# Altium schematic sheet Power.SchDoc: NH Speaker Sensor 16CH 2.3_C
size A3; Revision: 2.3; SheetNumber: 1; SheetTotal: 6
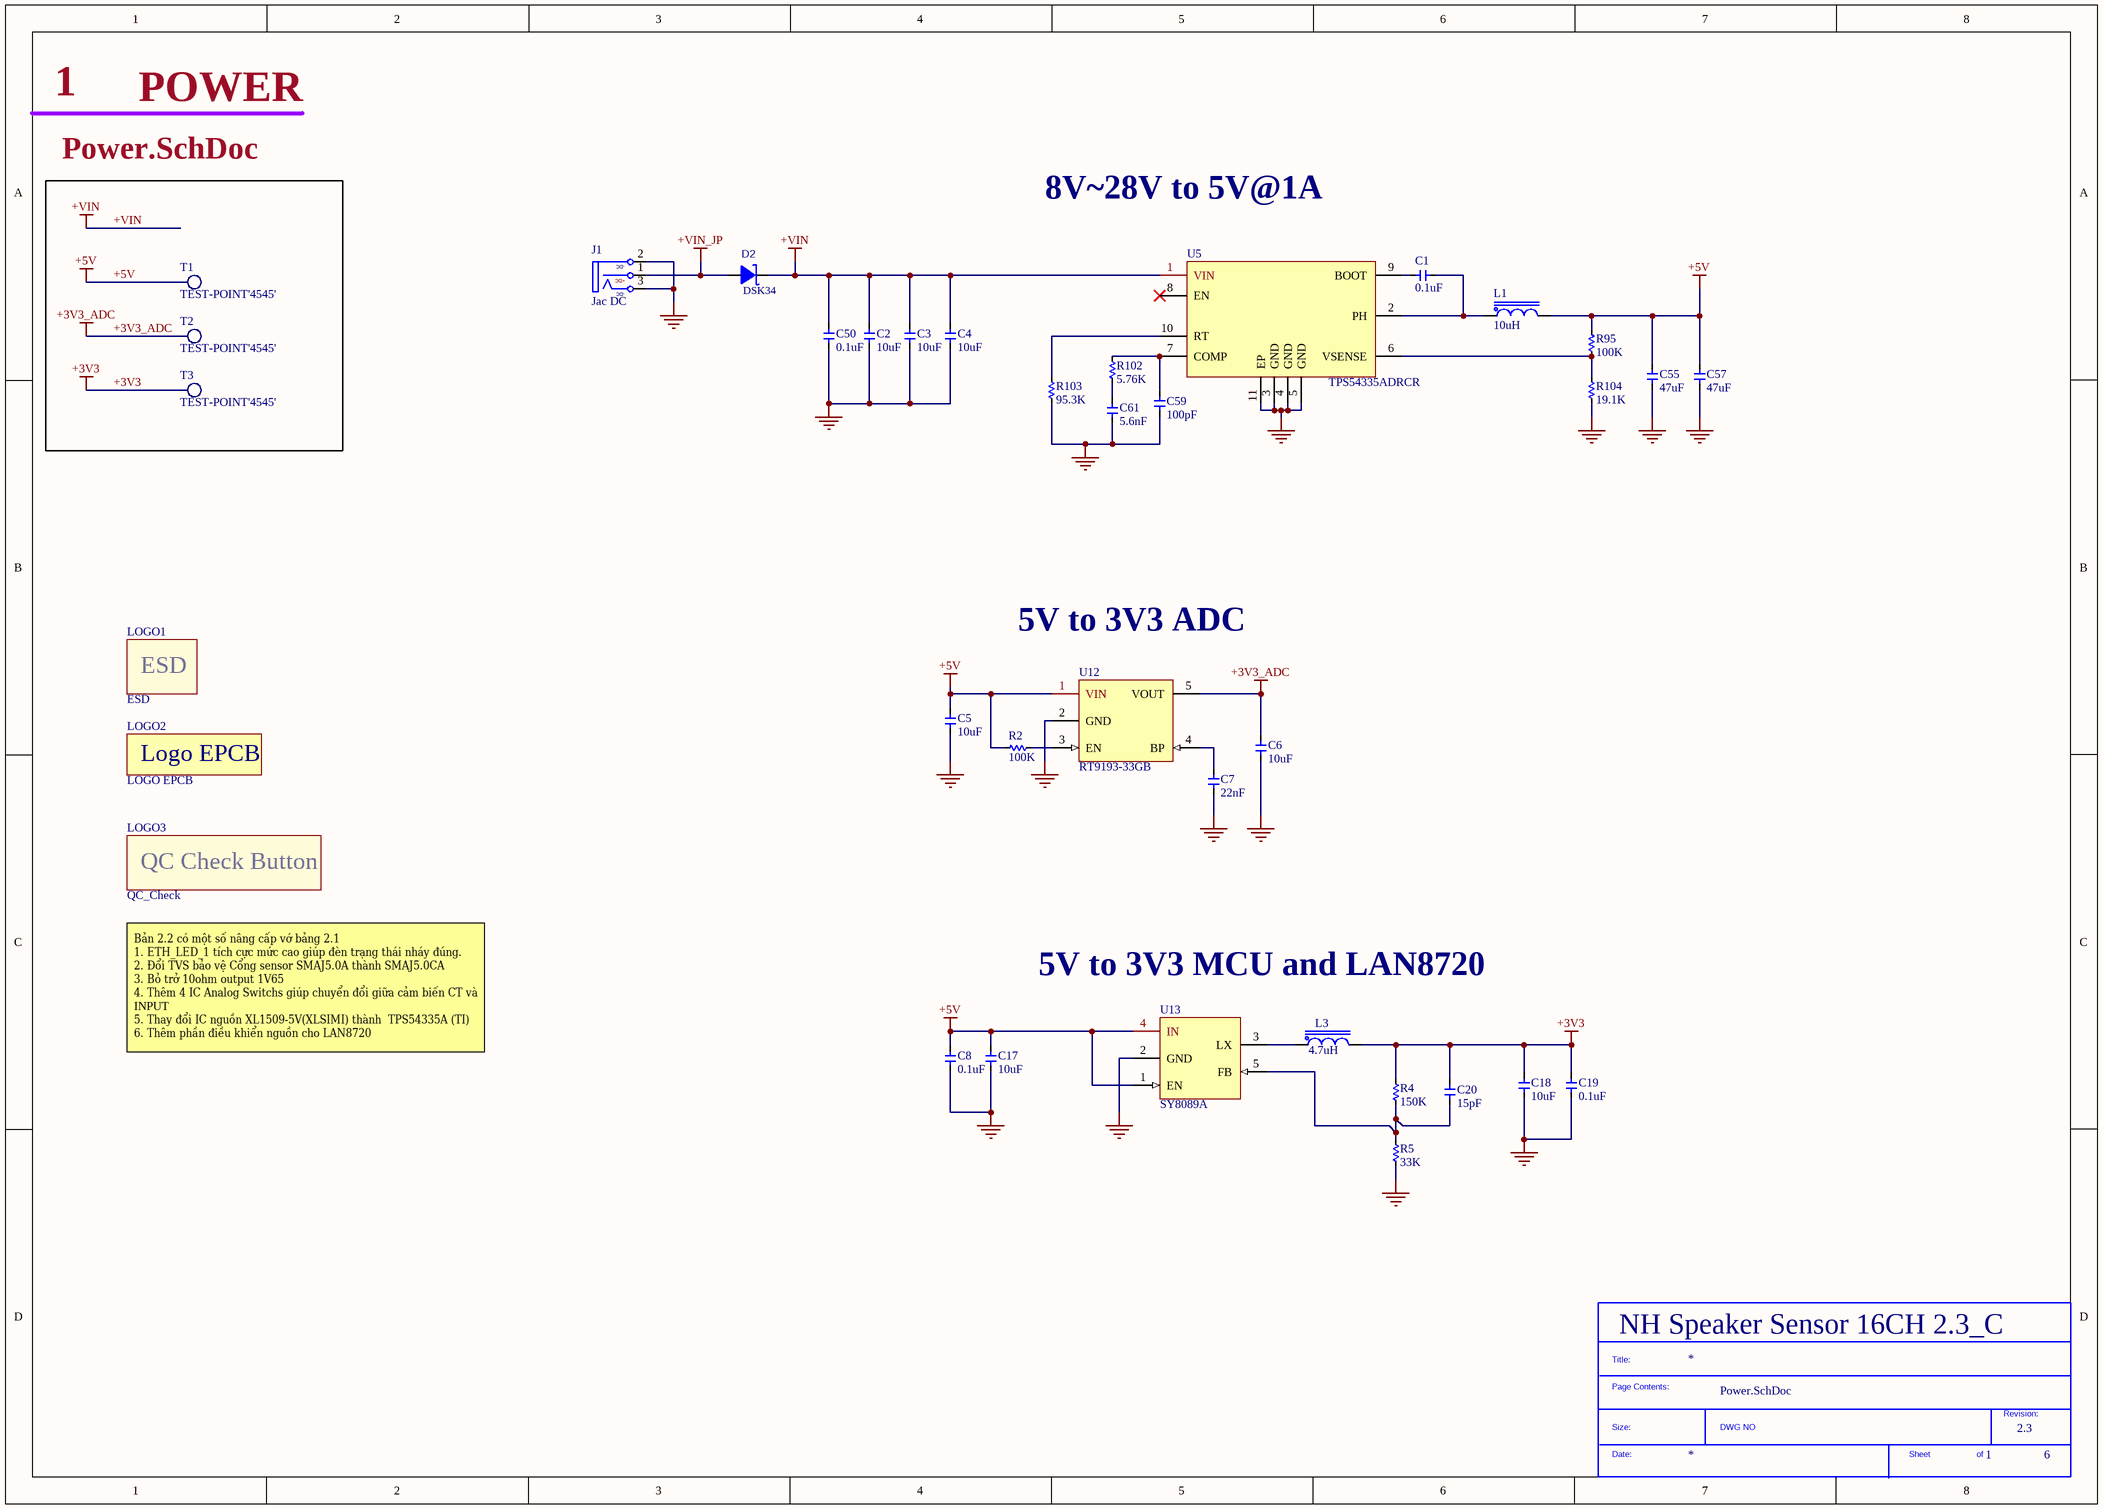
[diagram p0: Power.SchDoc]

## Parts
*?  SDTitleBlock  (value not drawn)  (graphical)
C1  0.1uF  [C_0603]
C2  10uF  [C_0805]
C3  10uF  [C_0805]
C4  10uF  [C_0805]
C5  10uF  [C_0603]
C6  10uF  [C_0603]
C7  22nF  [C_0603]
C8  0.1uF  [C_0603]
C17  10uF  [C_0805]
C18  10uF  [C_0805]
C19  0.1uF  [C_0603]
C20  15pF  [C_0603]
C50  0.1uF  [C_0603]
C55  47uF  [C_0805]
C57  47uF  [C_0805]
C59  100pF  [C_0603]
C61  5.6nF  [C_0603]
D2  DSK34  [SOD-123_L2.8-W1.8-LS3.7-RD]
J1  Jac DC  [DC0]
L1  10uH  [IND-SMD_L4.4-W4.2]
L3  4.7uH  [IND-SMD_L4.4-W4.2]
LOGO1  ESD  [LOGO ESD]  (no BOM)
LOGO2  LOGO EPCB  [LOGO EPCB TopLayer]  (no BOM)
LOGO3  QC_Check  [QC_CHECK]  (no BOM)
R2  100K  [R_0603]
R4  150K  [R_0603]
R5  33K  [R_0603]
R95  100K  [R_0603]
R102  5.76K  [R_0603]
R103  95.3K  [R_0603]
R104  19.1K  [R_0603]
T1  TEST-POINT'4545'  [TP-D45MIL]  (no BOM)
T2  TEST-POINT'4545'  [TP-D45MIL]  (no BOM)
T3  TEST-POINT'4545'  [TP-D45MIL]  (no BOM)
U5  TPS54335ADRCR  [VSON-10_L3.0-W3.0-P0.50-TL-EP]
U12  RT9193-33GB  [SOT-23-5_L3.0-W1.7-P0.95-LS2.8-BR]
U13  SY8089A  [SOT-23-5_L3.0-W1.7-P0.95-LS2.8-BR]

## Nets
+3V3: C18.2 C19.2 C20.2 L3.2 R4.1 T3.T
+3V3_ADC: C6.2 T2.T U12.5(VOUT)
+5V: C5.2 C8.2 C17.2 C55.2 C57.2 L1.2 R2.2 R95.1 T1.T U12.1(VIN) U13.1(EN) U13.4(IN)
+VIN: C2.2 C3.2 C4.2 C50.2 D2.1(A) U5.1(VIN)
+VIN_JP: D2.2(K) J1.1(S)
GND: C2.1 C3.1 C4.1 C5.1 C6.1 C7.1 C8.1 C17.1 C18.1 C19.1 C50.1 C55.1 C57.1 C59.1 C61.1 J1.2(T) J1.3(TN) R5.2 R103.2 R104.2 U5.3(GND) U5.4(GND) U5.5(GND) U5.11(EP) U12.2(GND) U13.2(GND)
NetC1_1: C1.1 L1.1 U5.2(PH)
NetC1_2: C1.2 U5.9(BOOT)
NetC7_2: C7.2 U12.4(BP)
NetC20_1: C20.1 R4.2 R5.1 U13.5(FB)
NetC59_2: C59.2 R102.1 U5.7(COMP)
NetC61_2: C61.2 R102.2
NetL3_1: L3.1 U13.3(LX)
NetR2_1: R2.1 U12.3(EN)
NetR95_2: R95.2 R104.1 U5.6(VSENSE)
NetR103_1: R103.1 U5.10(RT)

Not connected (* = marked no-connect by the designer): U5 8(EN)*

## Notes on the sheet
- POWER
- 8V~28V to 5V@1A
- 5V to 3V3 ADC
- 5V to 3V3 MCU and LAN8720
- (near LOGO3) Bản 2.2 có một số nâng cấp vớ bảng 2.1
  1. ETH_LED_1 tích cực mức cao giúp đèn trạng thái nháy đúng.
  2. Đổi TVS bảo vệ Cổng sensor SMAJ5.0A thành SMAJ5.0CA
  3. Bỏ trở 10ohm output 1V65
  4. Thêm 4 IC Analog Switchs giúp chuyển đổi giữa cảm biến CT và INPUT
  5. Thay đổi IC nguồn XL1509-5V(XLSIMI) thành  TPS54335A (TI)
  6. Thêm phần điều khiển nguồn cho LAN8720
- (in symbol DC+02I) -DC; +DC
- (in symbol LOGO EPCB TopLayer) Logo EPCB
- (in symbol QC_Check) QC Check Button
- (in symbol SDTitleBlock) Title:; Page Contents:; Revision:; Size:; DWG NO; Date:; Sheet; of

## Library data of the parts
*? = SDTitleBlock: TitleBlock
C1 C8 C19 C50 = CC0603KRX7R9BB104: 100NF 50V 0603 ROHS; Manufacturer: YAGEO; Manufacturer Part Number: CC0603KRX7R9BB104; Package: 0603; LCSC Part Number: C14663; Assembly type: SMT Assembly; ComponentLink1Description: Digikey Link; ComponentLink1URL: https://www.digikey.com/en/products/detail/yageo/CC0603KRX7R9BB104/2103082?s=N4IgTCBcDaIMwEYEFoFwCzuWZA5AIiALoC%2BQA; ComponentLink2Description: LCSC Link; ComponentLink2URL: https://jlcpcb.com/parts/componentSearch?searchTxt=10k%200603
C2-C4 C17 C18 = GRM21BR61H106KE43L: 10uF ±10% 50V X5R 0805; Manufacturer: Murata Electronics; ComponentLink1URL: https://lcsc.com/product-detail/Multilayer-Ceramic-Capacitors-MLCC-SMD-SMT_SAMSUNG_CL21A106KAYNNNE_10uF-106-10-25V_C15850.html/?href=jlc-SMT; ComponentLink1Description: LCSC Link; Manufacturer Part Number: GRM21BR61H106KE43L; LCSC Part Number: C440198; Package: 0805; Assembly Type: SMT Assembly
C5 C6 = CL10A106KP8NNNC: 10uF 10V 0603 Multilayer Ceramic Capacitors MLCC - SMD/SMT ROHS; Manufacturer: Samsung Electro-Mechanics; Manufacturer Part Number: CL10A106KP8NNNC; Package: 0603; LCSC Part Number: C19702; ComponentLink1Description: Digikey Link; ComponentLink1URL: https://www.digikey.com/en/products/detail/samsung-electro-mechanics/CL10A105KB8NNNC/3887518?s=N4IgTCBcDaIMIBkCMAGAgqgrAaQEIA4A5YuEAXQF8g; ComponentLink2Description: LCSC Link; ComponentLink2URL: https://jlcpcb.com/parts/componentSearch?searchTxt=10k%200603; Assembly Type: SMT Assembly
C7 = CL10B223KB8NNNC: 22nF 50V 0603 Multilayer Ceramic Capacitors MLCC - SMD/SMT ROHS; Manufacturer: Samsung Electro-Mechanics; Manufacturer Part Number: CL10B223KB8NNNC; Package: 0603; LCSC Part Number: C21122; ComponentLink1Description: Digikey Link; ComponentLink2Description: LCSC Link; ComponentLink2URL: https://jlcpcb.com/parts/componentSearch?searchTxt=10k%200603; Assembly Type: SMT Assembly
C20 = CL10C150JB8NNNC: 15pF ±5% 50V C0G 0603 Multilayer Ceramic Capacitors MLCC - SMD/SMT RoHS; Manufacturer: Samsung Electro-Mechanics; Manufacturer Part Number: CL10C150JB8NNNC; Package: 0603; LCSC Part Number: C1644; ComponentLink1Description: Digikey Link; Assembly Type: SMT Assembly
C55 C57 = GRM21BR61A476ME15L: 47uF ±20% 10V X5R 0805 Multilayer Ceramic Capacitors MLCC - SMD/SMT RoHS; Manufacturer: Murata Electronics; ComponentLink1URL: https://lcsc.com/product-detail/Multilayer-Ceramic-Capacitors-MLCC-SMD-SMT_SAMSUNG_CL21A106KAYNNNE_10uF-106-10-25V_C15850.html/?href=jlc-SMT; ComponentLink1Description: LCSC Link; Manufacturer Part Number: GRM21BR61A476ME15L; LCSC Part Number: C124129; Package: 0805; Assembly Type: SMT Assembly
C59 = 0603CG101J500NT: 100pF 50V C0G ±5% 0603 Multilayer Ceramic Capacitors MLCC - SMD/SMT ROHS; Manufacturer: FH(Guangdong Fenghua Advanced Tech); Manufacturer Part Number: 0603CG101J500NT; Package: 0603; LCSC Part Number: C1635; Assembly Type: SMT Assembly; ComponentLink1Description: Digikey Link; ComponentLink2Description: LCSC Link
C61 = 0603B562K500NT: 5.6nF 50V X7R ±10% 0603 Multilayer Ceramic Capacitors MLCC - SMD/SMT ROHS; Manufacturer: FH(Guangdong Fenghua Advanced Tech); Manufacturer Part Number: 0603B562K500NT; Package: 0603; LCSC Part Number: C1628; Assembly Type: SMT Assembly; ComponentLink1Description: Digikey Link
D2 = DSK34: DSK34 40V 550mV@3A 3A SOD-123 Schottky Barrier Diodes (SBD) ROHS Copy; Manufacturer: MDD（Microdiode Electronics); Manufacturer Part Number: DSK34; Package: SOD-123; LCSC Part Number: C41029; Assembly Type: SMT Assembly
J1 = DC+02I: Jac DC input 5.5x2.1MM; Manufacturer: JINJIA; Manufacturer Part Number: DC+02I; LCSC Part Number: C718033; Package: Through Hole; Assembly Type: Hand Soldering
L1 = IND_MWSA0402S-100MT: POWER INDUCTORS SMD,4.2X4.4X2.0MM ROHS; Manufacturer: Sunlord; ComponentLink1URL: http://www.mouser.com/ds/2/390/CDRH5D28RHP-523509.pdf?src-supplier=Mouser; ComponentLink1Description: http://www.mouser.com/ds/2/390/CDRH5D28RHP-523509.pdf?src-supplier=Mouser; ComponentLink2URL: http://products.sumida.com/products/pdf/CDRH5D28RHP.pdf?src-supplier=Digi-Key; ComponentLink2Description: http://products.sumida.com/products/pdf/CDRH5D28RHP.pdf?src-supplier=Digi-Key; ComponentLink3URL: http://www.sumida.com/products/pdf/CDRH5D28,5D28R,5D28RHP.pdf?src-supplier=Avnet; ComponentLink3Description: http://www.sumida.com/products/pdf/CDRH5D28,5D28R,5D28RHP.pdf?src-supplier=Avnet; ComponentLink4URL: http://datasheet.octopart.com/CDRH5D28RHPNP-4R7NC-Sumida-datasheet-8324507.pdf?src-supplier=_legacy+Avnet; ComponentLink4Description: http://datasheet.octopart.com/CDRH5D28RHPNP-4R7NC-Sumida-datasheet-8324507.pdf?src-supplier=_legacy+Avnet; Manufacturer Part Number: MWSA0402S-100MT; LCSC Part Number: C408339; Package: SMD-4.2x4.4x2.0; Assembly Type: SMT Assembly
L3 = IND_MWSA0402S-4R7MT: 4.7uH IND 4.2x4.4x2.0mm 2.8A 4.7uH ±20% 105mΩ SMD Power Inductors ROHS; Manufacturer: Sunlord; Manufacturer Part Number: MWSA0402S-4R7MT; LCSC Part Number: C408337; Package: SMD-4.2x4.4x2.0; Assembly Type: SMT Assembly
LOGO1 = ESD: lOGO ESD
LOGO2 = LOGO EPCB TopLayer
R2 R95 = 0603WAF1003T5E: 100KOHMS ±1% 1/10W 0603 ROHS; Manufacturer: Uniroyal Elec; Manufacturer Part Number: 0603WAF1003T5E; LCSC Part Number: C25803; Package: 0603; Assembly Type: SMT Assembly
R4 = 0603WAF1503T5E: 150kΩ ±1% ±100ppm/℃ 0.1W 0603 Chip Resistor - Surface Mount ROHS; Manufacturer: Uniroyal Elec; Manufacturer Part Number: 0603WAF1503T5E; LCSC Part Number: C22807; Package: 0603; Assembly Type: SMT Assembly
R5 = 0603WAF3302T5E: 33KOHMS ±1% 1/10W 0603 ROHS; Manufacturer: Uniroyal Elec; ComponentLink1URL: https://datasheet.ciiva.com/8883/pyu-rc0603-51-rohs-l-4-8883051.pdf?src-supplier=Avnet; ComponentLink1Description: https://datasheet.ciiva.com/8883/pyu-rc0603-51-rohs-l-4-8883051.pdf?src-supplier=Avnet; ComponentLink2URL: https://datasheet.ciiva.com/7746/443971-7746461.pdf?src-supplier=Element14; ComponentLink2Description: https://datasheet.ciiva.com/7746/443971-7746461.pdf?src-supplier=Element14; ComponentLink3URL: https://datasheet.ciiva.com/22747/443971-22747533.pdf?src-supplier=Element14; ComponentLink3Description: https://datasheet.ciiva.com/22747/443971-22747533.pdf?src-supplier=Element14; ComponentLink4URL: https://datasheet.ciiva.com/7746/443971-7746462.pdf?src-supplier=Element14; ComponentLink4Description: https://datasheet.ciiva.com/7746/443971-7746462.pdf?src-supplier=Element14; Manufacturer Part Number: 0603WAF3302T5E; LCSC Part Number: C4216; Package: 0603; Assembly Type: SMT Assembly
R102 = 0603WAF5761T5E: 5.76kΩ 0603 1/10W Thick Film Resistors 75V ±1% ±100ppm/℃ -55℃~+155℃ Chip Resistor - Surface Mount ROHS; Manufacturer: Uniroyal Elec; Manufacturer Part Number: 0603WAF5761T5E; LCSC Part Number: C23070; Package: 0603; Assembly Type: SMT Assembly
R103 = 0603WAF9532T5E: 95.3kΩ 0603 1/10W Thick Film Resistors 75V ±1% ±100ppm/℃ -55℃~+155℃ Chip Resistor - Surface Mount ROHS; Manufacturer: Uniroyal Elec; Manufacturer Part Number: 0603WAF9532T5E; LCSC Part Number: C23267; Package: 0603; Assembly Type: SMT Assembly
R104 = 0603WAF1912T5E: 19.1kΩ 0603 1/10W Thick Film Resistors 75V ±1% ±100ppm/℃ -55℃~+155℃ Chip Resistor - Surface Mount ROHS; Manufacturer: Uniroyal Elec; Manufacturer Part Number: 0603WAF1912T5E; LCSC Part Number: C22897; Package: 0603; Assembly Type: SMT Assembly
T1-T3 = TEST-POINT'4545': Manufacturer: No; Manufacturer Part Number: No; LCSC Part Number: No; Package: No
U5 = TPS54335ADRCR: TPS54335A 28V 3A SOP-8_EP_150mil DC-DC Converters RoHS; Manufacturer: Texas Instruments; Manufacturer Part Number: TPS54335ADRCR; ComponentLink1URL: http://www.jameco.com/Jameco/Products/ProdDS/1523997.pdf?src-supplier=Jameco; ComponentLink1Description: http://www.jameco.com/Jameco/Products/ProdDS/1523997.pdf?src-supplier=Jameco; ComponentLink2URL: http://www.ti.com/general/docs/lit/getliterature.tsp?genericPartNumber=TPS5431&&fileType=pdf&src-supplier=Avnet; ComponentLink2Description: http://www.ti.com/general/docs/lit/getliterature.tsp?genericPartNumber=TPS5431&&fileType=pdf&src-supplier=Avnet; ComponentLink3URL: http://focus.ti.com/lit/ds/symlink/tps5430.pdf?src-supplier=Avnet+Europe; ComponentLink3Description: http://focus.ti.com/lit/ds/symlink/tps5430.pdf?src-supplier=Avnet+Europe; ComponentLink4URL: http://www.ti.com/lit/ds/symlink/tps5431.pdf?src-supplier=Digi-Key; ComponentLink4Description: http://www.ti.com/lit/ds/symlink/tps5431.pdf?src-supplier=Digi-Key; ComponentLink5URL: https://www.verical.com/server-webapp/html/getDatasheet?partID=214658&src-supplier=Verical; ComponentLink5Description: https://www.verical.com/server-webapp/html/getDatasheet?partID=214658&src-supplier=Verical; ComponentLink6URL: http://www.produktinfo.conrad.com/datenblaetter/1000000-1099999/001014839-da-01-en-IC_REG_BUCK_ADJ_3_TPS5430DDAR_SOIC_8_TID.pdf?src-supplier=Conrad; ComponentLink6Description: http://www.produktinfo.conrad.com/datenblaetter/1000000-1099999/001014839-da-01-en-IC_REG_BUCK_ADJ_3_TPS5430DDAR_SOIC_8_TID.pdf?src-supplier=Conrad; Package: VSON-10; LCSC Part Number: C473400; Assembly Type: SMT Assembly
U12 = RT9193-33GB: 5.5V 300mV @ 300mA - - Fixed 3.3V SOT-23-5 Linear Voltage Regulators (LDO) ROHS; Manufacturer: Richtek Tech; Manufacturer Part Number: RT9193-33GB; Package: SOT-23-5; LCSC Part Number: C15651; Assembly Type: SMT Assembly
U13 = SY8089A1AAC: High Efficiency 5.5V, 2A continuous, 3A peak, 1MHz  Synchronous Step Down Regulator; Manufacturer: Silergy Corp; Manufacturer Part Number: SY8089A1AAC; LCSC Part Number: C479074; Package: SOT-23-5; Assembly Type: SMT Assembly